# EAGLE design ospiLCD (EAGLE 6.1)
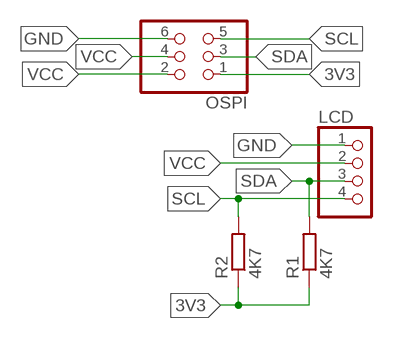
[diagram p0: schematic, sheet 1]

## Parts
LCD  PINHD-1X4  [1X04]
OSPI  PINHD-2X3  [2X03]
R1  4K7  R-EU_R0603  [R0603]
R2  4K7  R-EU_R0603  [R0603]

## Nets
3V3: OSPI.1 R1.1 R2.1
GND [power]: LCD.1 OSPI.6
SCL: LCD.4 OSPI.5 R2.2
SDA: LCD.3 OSPI.3 R1.2
VCC [power]: LCD.2 OSPI.2 OSPI.4

## Library data of the parts
LCD = pinhead:PINHD-1X4: PIN HEADER
OSPI = pinhead:PINHD-2X3: PIN HEADER
R1 R2 = resistor:R-EU_: RESISTOR, European symbol

## Net classes
1 power: width 0.5 mm, clearance 0.3 mm

## Board
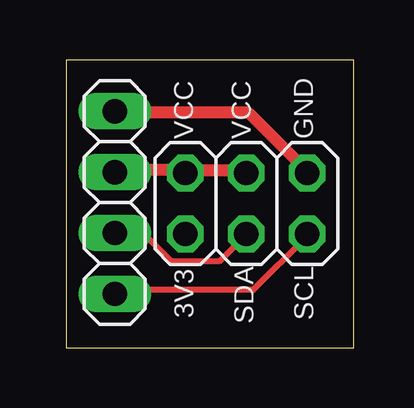
[diagram p1: board, top side]
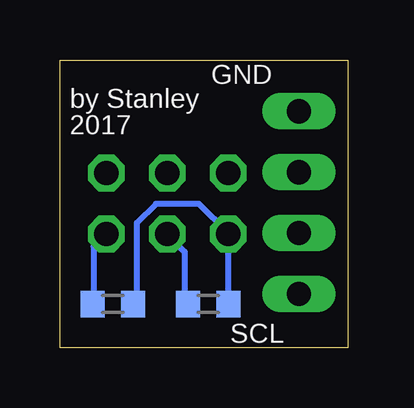
[diagram p2: board, bottom side, seen from below]

Size 12 x 12 mm. Coordinates in mm from the lower left corner, seen from the top.
Outline: 0,0 12,0 12,12 0,12 0,0
Copper layers (1*16): Top 0.035mm / dielectric 1.5mm / Bottom 0.035mm
Design rules: minimum track width 10mil, minimum drill 24mil, track to track 8mil, track to pad 8mil, pad to pad 8mil, via to via 8mil, smd to smd 8mil, copper to edge 40mil, drill to drill 8mil, minimum pad ring 10mil, minimum via ring 8mil, stop-mask expansion 4mil, vias tented up to drill 0mil, thermal gap 10mil

### Footprints (pad centres in the part's own frame; a part is rotated, then mirrored left to right if it is on the bottom)
1X04 = drill 1.016 long: 1 -3.81,0; 2 -1.27,0; 3 1.27,0; 4 3.81,0
2X03 = drill 1.016 octagon: 1 -2.54,-1.27; 2 -2.54,1.27; 3 0,-1.27; 4 0,1.27; 5 2.54,-1.27; 6 2.54,1.27
R0603 = smd 1 x 1.1: 1 -0.85,0; 2 0.85,0

### Placement (x,y rotation side)
LCD  2.03,6.05 270 top
OSPI  7.52,6.01 0 top
R1  5.81,1.82 180 bottom
R2  9.79,1.82 180 bottom

### Tracks (layer width: path | path; a pad name or v marks a point on that pad's centre or on a via)
3V3
  Bottom 0.254: R1.1 5,2 5,4.6 OSPI.1 5,4.8 6.2,6 8,6 8.8,5.2 8.8,2 R2.1
GND
  Top 0.5: LCD.1 2.2,9.8 7.6,9.8 10,7.4 OSPI.6
SCL
  Top 0.254: LCD.4 2.2,2.4 7.8,2.4 10,4.6 OSPI.5
  Bottom 0.254: OSPI.5 10.6,4.2 10.6,2 R2.2
SDA
  Top 0.254: LCD.3 2.2,4.6 3.4,4.6 4.4,3.6 6.4,3.6 7.4,4.6 OSPI.3
  Bottom 0.254: R1.2 6.8,2 6.8,4 7.4,4.6 OSPI.3
VCC
  Top 0.5: LCD.2 2.2,7.4 4.8,7.4 OSPI.2 5.2,7.4 7.4,7.4 OSPI.4

### Text on the board
tNames: VCC | VCC | GND | 3V3 | SDA | SCL
bNames: GND | by Stanley | 2017 | SCL